# Altium schematic sheet SX1276_e268v01a.SchDoc
size A3
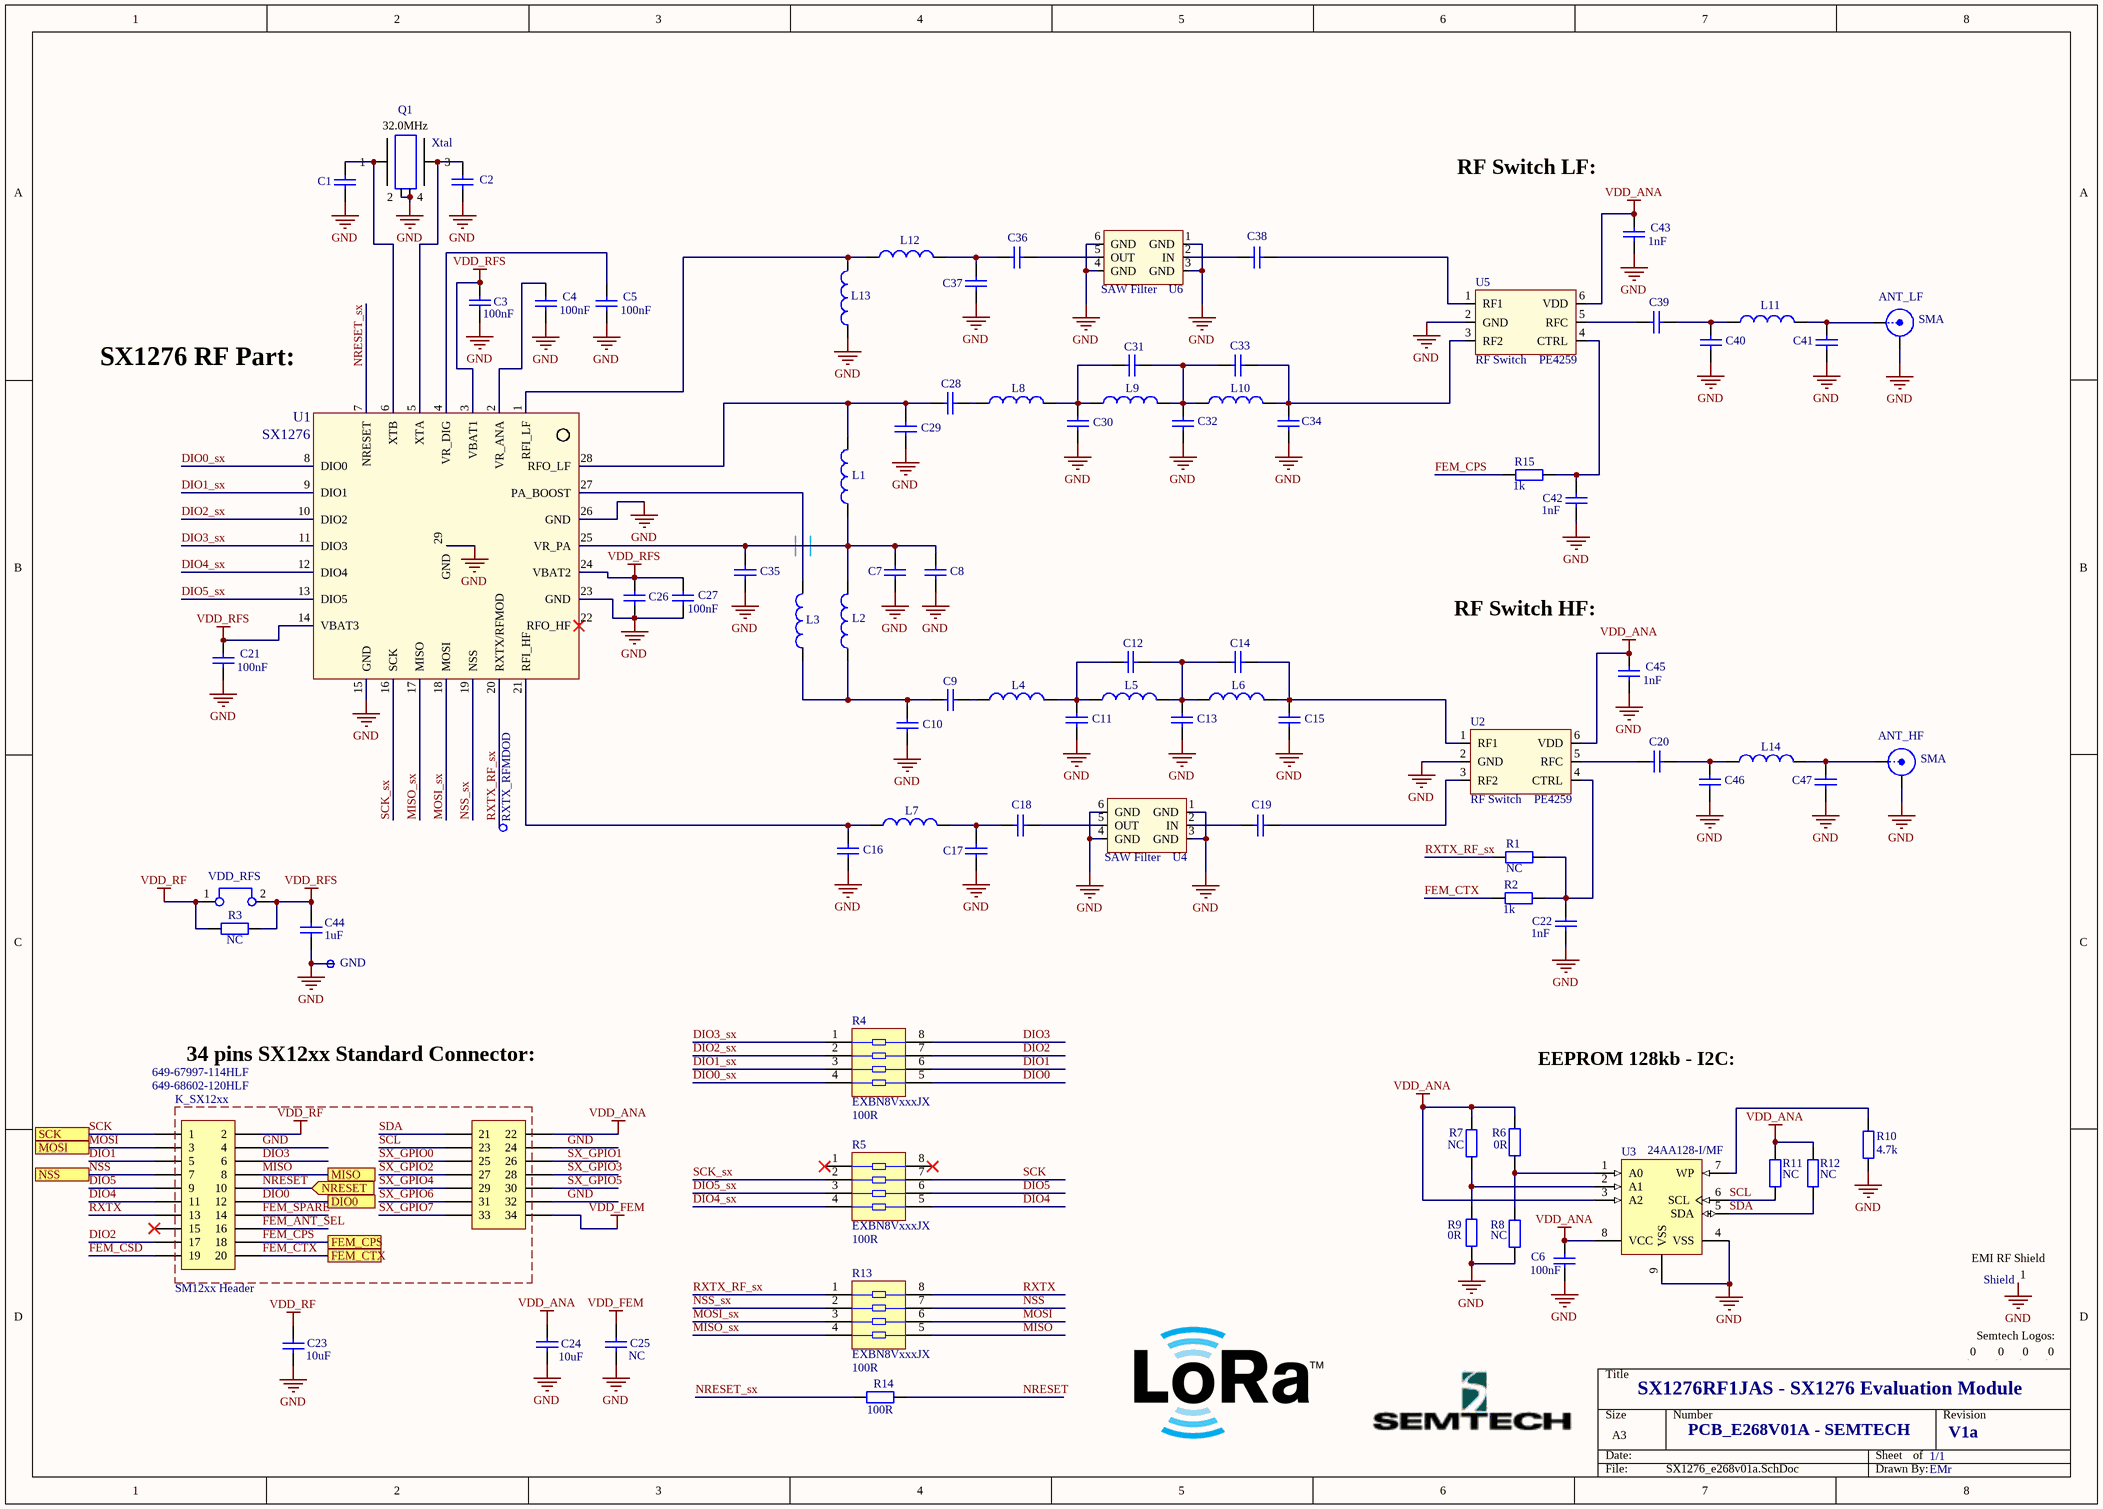
[diagram p0: SX1276_e268v01a.SchDoc]

## Parts
ANT_HF  SMA  [SMA END LAUNCH JACK RECEPTACLE SHORT]
ANT_LF  SMA  [SMA END LAUNCH JACK RECEPTACLE SHORT]
C1  Cap  [rlc_402_smd]  (value not drawn)
C2  Cap  [rlc_402_smd]  (value not drawn)
C3  value 100nF  [rlc_402_smd]  (hidden comment: Cap)
C4  value 100nF  [rlc_402_smd]  (hidden comment: Cap)
C5  value 100nF  [rlc_402_smd]  (hidden comment: Cap)
C6  value 100nF  [rlc_402_smd]  (hidden comment: Cap)
C7  Cap  [rlc_402_smd]  (value not drawn)
C8  Cap  [rlc_402_smd]  (value not drawn)
C9  Cap  [rlc_402_smd]  (value not drawn)
C10  Cap  [rlc_402_smd]  (value not drawn)
C11  Cap  [rlc_402_smd]  (value not drawn)
C12  Cap  [rlc_402_smd]  (value not drawn)
C13  Cap  [rlc_402_smd]  (value not drawn)
C14  Cap  [rlc_402_smd]  (value not drawn)
C15  Cap  [rlc_402_smd]  (value not drawn)
C16  Cap  [rlc_402_smd]  (value not drawn)
C17  Cap  [rlc_402_smd]  (value not drawn)
C18  Cap  [rlc_402_smd]  (value not drawn)
C19  Cap  [rlc_402_smd]  (value not drawn)
C20  Cap  [rlc_402_smd]  (value not drawn)
C21  value 100nF  [rlc_402_smd]  (hidden comment: Cap)
C22  value 1nF  [rlc_402_smd]  (hidden comment: Cap)
C23  value 10uF  [rlc_805_smd]  (hidden comment: Cap)
C24  value 10uF  [rlc_805_smd]  (hidden comment: Cap)
C25  value NC  [rlc_805_smd]  (hidden comment: Cap)
C26  Cap  [rlc_402_smd]  (value not drawn)
C27  value 100nF  [rlc_402_smd]  (hidden comment: Cap)
C28  Cap  [rlc_402_smd]  (value not drawn)
C29  Cap  [rlc_402_smd]  (value not drawn)
C30  Cap  [rlc_402_smd]  (value not drawn)
C31  Cap  [rlc_402_smd]  (value not drawn)
C32  Cap  [rlc_402_smd]  (value not drawn)
C33  Cap  [rlc_402_smd]  (value not drawn)
C34  Cap  [rlc_402_smd]  (value not drawn)
C35  Cap  [rlc_402_smd]  (value not drawn)
C36  Cap  [rlc_402_smd]  (value not drawn)
C37  Cap  [rlc_402_smd]  (value not drawn)
C38  Cap  [rlc_402_smd]  (value not drawn)
C39  Cap  [rlc_402_smd]  (value not drawn)
C40  Cap  [rlc_402_smd]  (value not drawn)
C41  Cap  [rlc_402_smd]  (value not drawn)
C42  value 1nF  [rlc_402_smd]  (hidden comment: Cap)
C43  value 1nF  [rlc_402_smd]  (hidden comment: Cap)
C44  value 1uF  [rlc_603_smd]  (hidden comment: Cap Semi)
C45  value 1nF  [rlc_402_smd]  (hidden comment: Cap)
C46  Cap  [rlc_402_smd]  (value not drawn)
C47  Cap  [rlc_402_smd]  (value not drawn)
GND  Test Pin  [pin_1mm]  (value not drawn)
K_SX12xx  SM12xx Header  Supplier Part Number 1: 649-68602-120HLF  Supplier Part Number 2: 649-67997-114HLF  [HDR34 Header]
L1  Inductor  [rlc_402_smd]  (value not drawn)
L2  Inductor  [rlc_402_smd]  (value not drawn)
L3  Inductor  [rlc_402_smd]  (value not drawn)
L4  Inductor  [rlc_402_smd]  (value not drawn)
L5  Inductor  [rlc_402_smd]  (value not drawn)
L6  Inductor  [rlc_402_smd]  (value not drawn)
L7  Inductor  [rlc_402_smd]  (value not drawn)
L8  Inductor  [rlc_402_smd]  (value not drawn)
L9  Inductor  [rlc_402_smd]  (value not drawn)
L10  Inductor  [rlc_402_smd]  (value not drawn)
L11  Inductor  [rlc_402_smd]  (value not drawn)
L12  Inductor  [rlc_402_smd]  (value not drawn)
L13  Inductor  [rlc_402_smd]  (value not drawn)
L14  Inductor  [rlc_402_smd]  (value not drawn)
Logo_Bot  Logo symbol  [logo_semtech_horiz_size3]  (value not drawn)
Logo_Lora_Bot  Logo symbol  [Logo LoRa Size4]  (value not drawn)
Logo_Lora_Top  Logo symbol  [Logo LoRa Size3]  (value not drawn)
Logo_Top  Logo symbol  [logo_semtech_horiz_size2]  (value not drawn)
Q1  Xtal  value 32.0MHz  [nd3225da - nd2520da]
R1  value NC  [rlc_402_smd]  (hidden comment: Resistor)
R2  value 1k  [rlc_402_smd]  (hidden comment: Resistor)
R3  value NC  [rlc_805_smd]  (hidden comment: Resistor)
R4  EXBN8VxxxJX  value 100R  [EXB28V]
R5  EXBN8VxxxJX  value 100R  [EXB28V]
R6  value 0R  [rlc_402_smd]  (hidden comment: Resistor)
R7  value NC  [rlc_402_smd]  (hidden comment: Resistor)
R8  value NC  [rlc_402_smd]  (hidden comment: Resistor)
R9  value 0R  [rlc_402_smd]  (hidden comment: Resistor)
R10  value 4.7k  [rlc_402_smd]  (hidden comment: Resistor)
R11  value NC  [rlc_402_smd]  (hidden comment: Resistor)
R12  value NC  [rlc_402_smd]  (hidden comment: Resistor)
R13  EXBN8VxxxJX  value 100R  [EXB28V]
R14  value 100R  [rlc_402_smd]  (hidden comment: Resistor)
R15  value 1k  [rlc_402_smd]  (hidden comment: Resistor)
RXTX_RFMDOD  Test Pin  [pin_SMD]  (value not drawn)
Shield  Logo symbol  [BMIS-205-F - Shield]  (value not drawn)
U1  SX1276  [vqfn28_6x6mm]
U2  RF Switch  value PE4259  [SC70-6]
U3  24AA128-I/MF  [DFN8_ 5x6mm]
U4  SAW Filter  [DCC6C_3.0x3.0mm]
U5  RF Switch  value PE4259  [SC70-6]
U6  SAW Filter  [DCC6C_3.0x3.0mm]
VDD_RFS  Jumper  [bridge_254mm]  (value not drawn)

## Ports
DIO0, FEM_CPS, FEM_CTX, MISO, MOSI, NRESET (in), NSS, SCK

## Nets
GND: ANT_HF.2(GND) ANT_LF.2(GND) C1.1 C2.1 C3.1 C4.1 C5.1 C6.1 C7.1 C8.1 C10.1 C11.1 C13.1 C15.1 C16.1 C17.1 C21.1 C22.2 C23.1 C24.1 C25.2 C26.1 C27.1 C29.1 C30.1 C32.1 C34.1 C35.1 C37.1 C40.1 C41.1 C42.2 C43.1 C44.1 C45.1 C46.1 C47.1 GND.1(pin) K_SX12xx.4 K_SX12xx.24 K_SX12xx.32 L13.1 Q1.2 Q1.4 R8.1 R9.1 R10.1 Shield.1 U1.15(GND) U1.23(GND) U1.26(GND) U1.29(GND) U2.2(GND) U3.4(VSS) U3.9(VSS) U4.1(GND) U4.3(GND) U4.4(GND) U4.6(GND) U5.2(GND) U6.1(GND) U6.3(GND) U6.4(GND) U6.6(GND)
VDD_ANA: C6.2 C24.2 C43.2 C45.2 K_SX12xx.22 R6.2 R7.2 R11.2 R12.2 U2.6(VDD) U3.3(A2) U3.8(VCC) U5.6(VDD)
VDD_FEM: C25.1 K_SX12xx.34
VDD_RF: C23.2 K_SX12xx.2 R3.2 VDD_RFS.1
VDD_RFS: C3.2 C21.2 C26.2 C27.2 C44.2 R3.1 U1.3(VBAT1) U1.14(VBAT3) U1.24(VBAT2) VDD_RFS.2
DIO0: K_SX12xx.12 R4.5 ; port DIO0
DIO0_sx: R4.4 U1.8(DIO0)
DIO1: K_SX12xx.5 R4.6
DIO1_sx: R4.3 U1.9(DIO1)
DIO2: K_SX12xx.17 R4.7
DIO2_sx: R4.2 U1.10(DIO2)
DIO3: K_SX12xx.6 R4.8
DIO3_sx: R4.1 U1.11(DIO3)
DIO4: K_SX12xx.11 R5.5
DIO4_sx: R5.4 U1.12(DIO4)
DIO5: K_SX12xx.9 R5.6
DIO5_sx: R5.3 U1.13(DIO5)
FEM_ANT_SEL: K_SX12xx.16
FEM_CPS: K_SX12xx.18 R15.2 ; port FEM_CPS
FEM_CSD: K_SX12xx.19
FEM_CTX: K_SX12xx.20 R2.2 ; port FEM_CTX
FEM_SPARE: K_SX12xx.14
MISO: K_SX12xx.8 R13.5 ; port MISO
MISO_sx: R13.4 U1.17(MISO)
MOSI: K_SX12xx.3 R13.6 ; port MOSI
MOSI_sx: R13.3 U1.18(MOSI)
NRESET: K_SX12xx.10 R14.2 ; port NRESET
NRESET_sx: R14.1 U1.7(NRESET)
NSS: K_SX12xx.7 R13.7 ; port NSS
NSS_sx: R13.2 U1.19(NSS)
RXTX: K_SX12xx.13 R13.8
RXTX_RF_sx: R1.1 R13.1 RXTX_RFMDOD.1(pin) U1.20(RXTX/RFMOD)
SCK: K_SX12xx.1 R5.7 ; port SCK
SCK_sx: R5.2 U1.16(SCK)
SCL: K_SX12xx.23 R11.1 U3.6(SCL)
SDA: K_SX12xx.21 R12.1 U3.5(SDA)
SX_GPIO0: K_SX12xx.25
SX_GPIO1: K_SX12xx.26
SX_GPIO2: K_SX12xx.27
SX_GPIO3: K_SX12xx.28
SX_GPIO4: K_SX12xx.29
SX_GPIO5: K_SX12xx.30
SX_GPIO6: K_SX12xx.31
SX_GPIO7: K_SX12xx.33
NetANT_HF_1: ANT_HF.1(Signal) C47.2 L14.2
NetANT_LF_1: ANT_LF.1(Signal) C41.2 L11.2
NetC1_2: C1.2 Q1.1 U1.6(XTB)
NetC2_2: C2.2 Q1.3 U1.5(XTA)
NetC4_2: C4.2 U1.2(VR_ANA)
NetC5_2: C5.2 U1.4(VR_DIG)
NetC7_2: C7.2 C8.2 C35.2 L1.1 L2.2 U1.25(VR_PA)
NetC9_1: C9.1 L4.1
NetC9_2: C9.2 C10.2 L2.1 L3.1
NetC11_2: C11.2 C12.2 L4.2 L5.1
NetC12_1: C12.1 C13.2 C14.2 L5.2 L6.1
NetC14_1: C14.1 C15.2 L6.2 U2.1(RF1)
NetC16_2: C16.2 L7.1 U1.21(RFI_HF)
NetC17_2: C17.2 C18.2 L7.2
NetC18_1: C18.1 U4.5(OUT)
NetC19_1: C19.1 U2.3(RF2)
NetC19_2: C19.2 U4.2(IN)
NetC20_1: C20.1 C46.2 L14.1
NetC20_2: C20.2 U2.5(RFC)
NetC22_1: C22.1 R1.2 R2.1 U2.4(CTRL)
NetC28_1: C28.1 L8.1
NetC28_2: C28.2 C29.2 L1.2 U1.28(RFO_LF)
NetC30_2: C30.2 C31.2 L8.2 L9.1
NetC31_1: C31.1 C32.2 C33.2 L9.2 L10.1
NetC33_1: C33.1 C34.2 L10.2 U5.3(RF2)
NetC36_1: C36.1 U6.5(OUT)
NetC36_2: C36.2 C37.2 L12.2
NetC38_1: C38.1 U5.1(RF1)
NetC38_2: C38.2 U6.2(IN)
NetC39_1: C39.1 C40.2 L11.1
NetC39_2: C39.2 U5.5(RFC)
NetC42_1: C42.1 R15.1 U5.4(CTRL)
NetL3_2: L3.2 U1.27(PA_BOOST)
NetL12_1: L12.1 L13.2 U1.1(RFI_LF)
NetR6_1: R6.1 R8.2 U3.1(A0)
NetR7_1: R7.1 R9.2 U3.2(A1)
NetR10_2: R10.2 U3.7(WP)

Not connected (* = marked no-connect by the designer): K_SX12xx 15*; Logo_Bot 0; Logo_Lora_Bot 0; Logo_Lora_Top 0; Logo_Top 0; R5 1* 8*; U1 22(RFO_HF)*

## Notes on the sheet
- RF Switch LF:
- (near U1) SX1276 RF Part:
- RF Switch HF:
- 34 pins SX12xx Standard Connector:
- EEPROM 128kb - I2C:
- (near Shield) EMI RF Shield
- SX1276RF1JAS - SX1276 Evaluation Module
- Semtech Logos:
- PCB_E268V01A - SEMTECH
- 1/1
- V1a
- EMr

## Library data of the parts
ANT_HF ANT_LF = SMA: SMA Straight Connector; LatestRevisionDate: 05-oct-2007  -  Semtech; LatestRevisionNote: Re-released for DXP Platform.; Publisher: Altium Limited
C1 = Cap: Capacitor SMD; Value: 18pnF; Published: 8-Jun-2000; LatestRevisionDate: 05-oct-2007  -  Semtech; LatestRevisionNote: Re-released for DXP Platform.; Publisher: Altium Limited
C2 = Cap: Capacitor SMD; Value: 18pF; Published: 8-Jun-2000; LatestRevisionDate: 05-oct-2007  -  Semtech; LatestRevisionNote: Re-released for DXP Platform.; Publisher: Altium Limited
C3-C6 C21-C25 C27 C42 C43 C45 = Cap: Capacitor SMD; Published: 8-Jun-2000; LatestRevisionDate: 05-oct-2007  -  Semtech; LatestRevisionNote: Re-released for DXP Platform.; Publisher: Altium Limited
C7-C20 C28-C33 C35-C39 = Cap: Capacitor SMD; Value: 100nF; Published: 8-Jun-2000; LatestRevisionDate: 05-oct-2007  -  Semtech; LatestRevisionNote: Re-released for DXP Platform.; Publisher: Altium Limited
C26 = Cap: Capacitor SMD; Value: 100pF; Published: 8-Jun-2000; LatestRevisionDate: 05-oct-2007  -  Semtech; LatestRevisionNote: Re-released for DXP Platform.; Publisher: Altium Limited
C34 C40 C41 C46 C47 = Cap: Capacitor SMD; Value: NC; Published: 8-Jun-2000; LatestRevisionDate: 05-oct-2007  -  Semtech; LatestRevisionNote: Re-released for DXP Platform.; Publisher: Altium Limited
C44 = Cap Semi: Capacitor (Semiconductor SIM Model); Published: 8-Jun-2000; LatestRevisionDate: 05-oct-2007  -  Semtech; LatestRevisionNote: Re-released for DXP Platform.; Publisher: Altium Limited
GND RXTX_RFMDOD = test_pin: LatestRevisionDate: 05-oct-2007  -  Semtech
K_SX12xx = SM12xx Header: SM12xx Header; 34pins: 2x10pins + 2x7pins; LatestRevisionDate: 24.8.2012; LatestRevisionNote: Re-released for DXP Platform.; Publisher: Altium Limited; Supplier 1: Mouser; Supplier 2: Mouser
L1-L9 L12 L13 = Inductor: Inductor SMD; Code_IEC: 1005; Value: VAL?; Published: 8-Jun-2000; LatestRevisionDate: 05-oct-2007  -  Semtech; LatestRevisionNote: Re-released for DXP Platform.; Publisher: Altium Limited; Code_JEITA: 0402
L10 L11 L14 = Inductor: Inductor SMD; Code_IEC: 1005; Value: 0R; Published: 8-Jun-2000; LatestRevisionDate: 05-oct-2007  -  Semtech; LatestRevisionNote: Re-released for DXP Platform.; Publisher: Altium Limited; Code_JEITA: 0402
Logo_Bot Logo_Lora_Bot Logo_Lora_Top Logo_Top = Logo: Schematic symbol for Logo
Q1 = Xtal GND: Crystal with GND pins; LatestRevisionDate: 05-oct-2007  -  Semtech
R1-R3 R6-R12 R14 R15 = Resistor: Resistor SMD - IEC symbol version; LatestRevisionDate: 27-Jul-20  -  Semtech
R4 R5 R13 = EXBN8VxxxJX: Mini-Flat Package, Isolated Resistor Network, 0.031 W/resistor
Shield = Shield: Shield - EMI Gasket - Standard Surface Mount Shields
U1 = SX1276: SX1276 - Low Power Integrated UHF Transceiver with loRa Modem; LatestRevisionDate: 27-Jul-2009 -  Semtech
U2 U5 = PE4259 RF Switch: PE4259 Peregrine RF Switch; LatestRevisionDate: 03-Sep-2012 -  Semtech
U3 = 24AA128-I/MF: 128kbit, 400kHz, 1.7V, 8-Pin DFN, Industrial Temperature; Published: 2-Dec-2009; DatasheetVersion: revF, Oct-2008; PackageVersion: revBB, Aug-2009; Publisher: Altium Limited; Supplier 1: Digi-Key; Supplier Part Number 1: 24AA128-I/MF; ComponentLink2Description: Packaging Specification; ComponentLink3Description: Microchip.com Home; ComponentLink3URL: http://www.microchip.com/
U4 U6 = SAW Filter: SAW Filter - Bandpass - TEMEX type; LatestRevisionDate: 05-oct-2007  -  Semtech
VDD_RFS = Jumper: Jumper Wire; LatestRevisionDate: 05-oct-2007  -  Semtech